# Altium schematic sheet MCU.SchDoc
size Letter; SheetNumber: 1; SheetTotal: 3
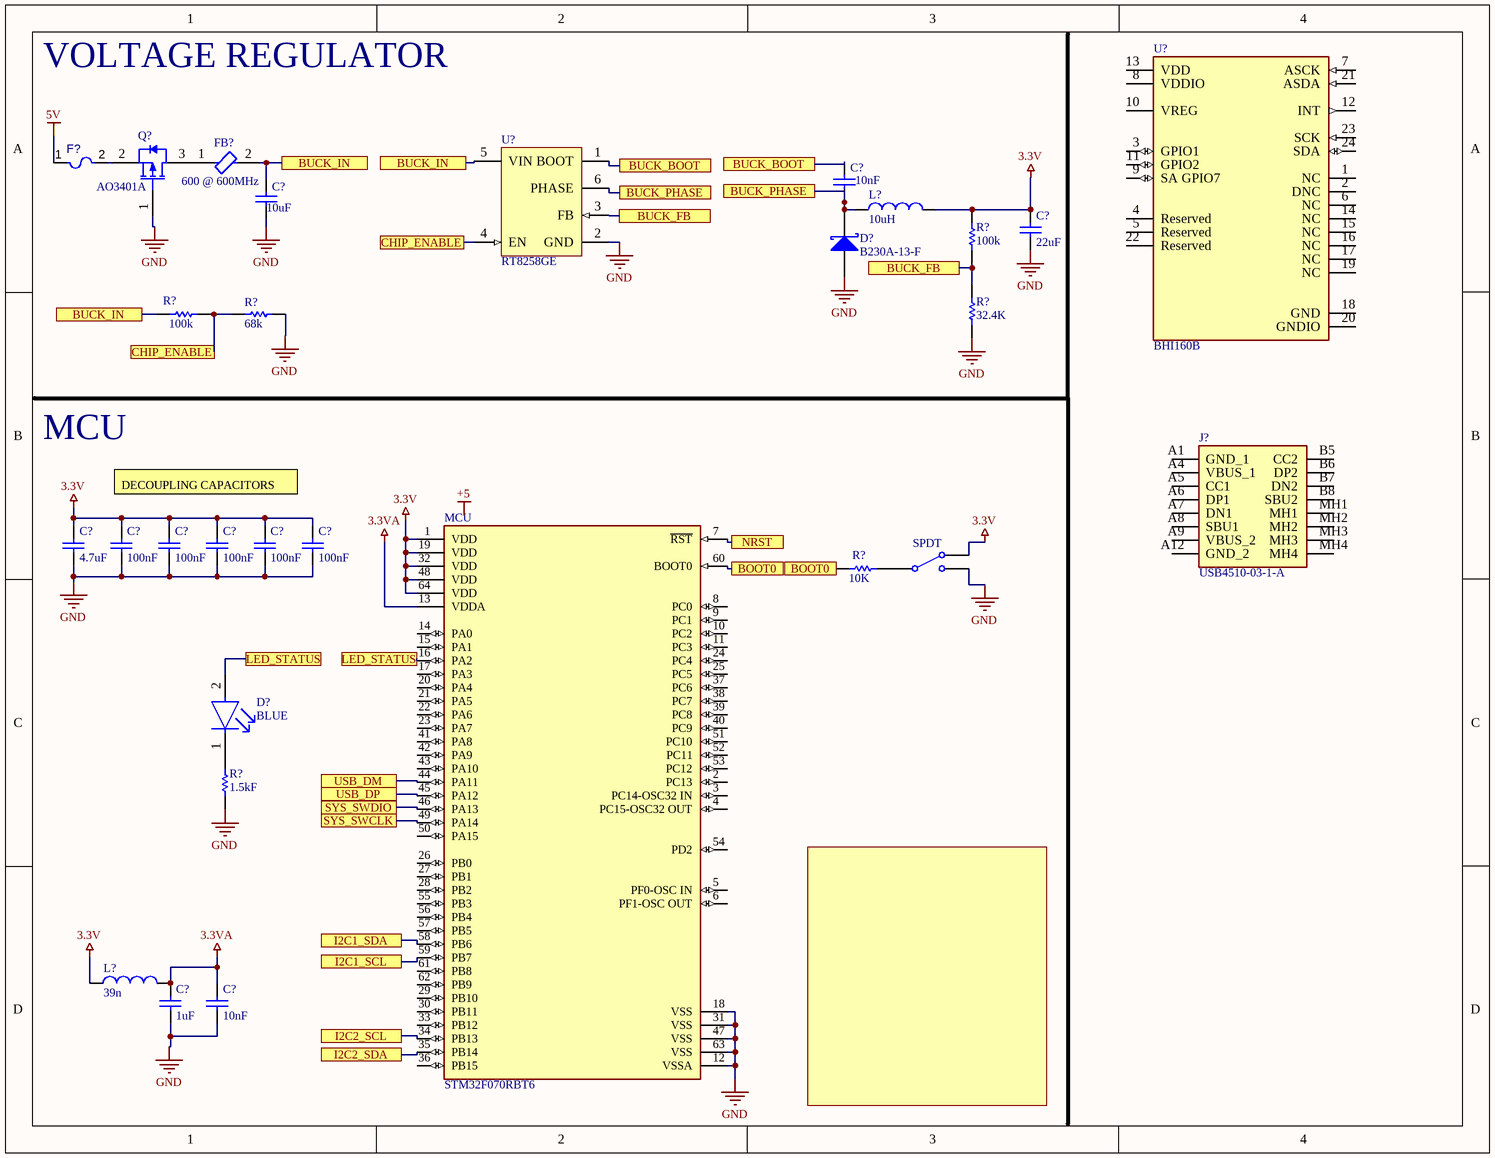
[diagram p0: MCU.SchDoc]

## Parts
(Parts that share a designator on the sheet are numbered #1, #2 ... from top to bottom, then left to right.)
C?#1  value 10nF  (hidden comment: Capacitor)
C?#2  value 10uF  (hidden comment: Capacitor)
C?#3  value 22uF  (hidden comment: Capacitor)
C?#4  value 4.7uF  (hidden comment: Capacitor)
C?#5  value 100nF  (hidden comment: Capacitor)
C?#6  value 100nF  (hidden comment: Capacitor)
C?#7  value 100nF  (hidden comment: Capacitor)
C?#8  value 100nF  (hidden comment: Capacitor)
C?#9  value 100nF  (hidden comment: Capacitor)
C?#10  value 1uF  (hidden comment: Capacitor)
C?#11  value 10nF  (hidden comment: Capacitor)
D?#1  B230A-13-F  [DIOD-SMA-2_V]
D?#2  BLUE  [FP-LTST-C191TBKT-MFG]
F?  (no value)  [LFUS-1812L050_V]
FB?  600 @ 600MHz  [FP-BLM15-0_05-IPC_B]
J?  USB4510-03-1-A  [USB4510031A]
L?#1  value 10uH  (hidden comment: Inductor)
L?#2  value 39n  (hidden comment: Inductor)
MCU  STM32F070RBT6  [FP-LQFP64-5W-MFG]
Q?  AO3401A  [AO-SOT-23-3L_V]
R?#1  value 100k  (hidden comment: Resistor)
R?#2  value 100k  (hidden comment: Resistor)
R?#3  value 68k  (hidden comment: Resistor)
R?#4  value 32.4K  (hidden comment: Resistor)
R?#5  value 10K  (hidden comment: Resistor)
R?#6  value 1.5kF  (hidden comment: Resistor)
SPDT  Single-Pole, Double-Throw Switch  (value not drawn)
U?#1  BHI160B  [FP-BHI160B-MFG]
U?#2  RT8258GE  [RCHT-SOT-23-6_L]

## Ports
BOOT0 (see MCU[2B]), BOOT0 (see MCU[3B]), BUCK_BOOT (see MCU[2A]), BUCK_FB (see MCU[2A]), BUCK_FB (see MCU[3A]), BUCK_IN (see MCU[1A], MCU[1B]), BUCK_IN (see MCU[1A], MCU[2A]), BUCK_IN (see MCU[1B], MCU[2A]), BUCK_PHASE (see MCU[2A]), CHIP_ENABLE (see MCU[1B]), CHIP_ENABLE (see MCU[2A]), I2C1_SCL, I2C1_SDA, I2C2_SCL, I2C2_SDA, LED_STATUS (see MCU[1C]), NRST, SYS_SWCLK, SYS_SWDIO, USB_DM, USB_DP

## Nets
3.3V: C?#3.2 C?#4.2 C?#5.2 C?#6.2 C?#7.2 C?#8.2 C?#9.2 L?#1.2 L?#2.1 MCU.1(VDD) MCU.19(VDD) MCU.32(VDD) MCU.48(VDD) MCU.64(VDD) R?#1.2 SPDT.3
3.3VA: C?#10.2 C?#11.2 L?#2.2 MCU.13(VDDA)
5V: F?.1
GND: C?#2.1 C?#3.1 C?#4.1 C?#5.1 C?#6.1 C?#7.1 C?#8.1 C?#9.1 C?#10.1 C?#11.1 D?#1.1(A) MCU.12(VSSA) MCU.18(VSS) MCU.31(VSS) MCU.47(VSS) MCU.63(VSS) Q?.1(GATE) R?#3.1 R?#4.1 R?#6.1 SPDT.2 U?#2.2(GND)
BOOT0: MCU.60(BOOT0) R?#5.1 ; port BOOT0
BUCK_BOOT: C?#1.2 U?#2.1(BOOT) ; port BUCK_BOOT
BUCK_FB: R?#1.1 R?#4.2 U?#2.3(FB) ; port BUCK_FB
BUCK_IN: C?#2.2 FB?.2 R?#2.2 U?#2.5(VIN) ; port BUCK_IN
BUCK_PHASE: C?#1.1 D?#1.2(K) L?#1.1 U?#2.6(PHASE) ; port BUCK_PHASE
CHIP_ENABLE: R?#2.1 R?#3.2 U?#2.4(EN) ; port CHIP_ENABLE
I2C1_SCL: MCU.59(PB7) ; port I2C1_SCL
I2C1_SDA: MCU.58(PB6) ; port I2C1_SDA
I2C2_SCL: MCU.34(PB13) ; port I2C2_SCL
I2C2_SDA: MCU.35(PB14) ; port I2C2_SDA
LED_STATUS: D?#2.2(A) MCU.16(PA2) ; port LED_STATUS
NRST: MCU.7(~{RST}) ; port NRST
SYS_SWCLK: MCU.49(PA14) ; port SYS_SWCLK
SYS_SWDIO: MCU.46(PA13) ; port SYS_SWDIO
USB_DM: MCU.44(PA11) ; port USB_DM
USB_DP: MCU.45(PA12) ; port USB_DP
NetD?#2_1: D?#2.1(C) R?#6.2
NetF?_2: F?.2 Q?.2(SOURCE)

Not connected (* = marked no-connect by the designer): FB? 1; J? A1(GND_1) A4(VBUS_1) A5(CC1) A6(DP1) A7(DN1) A8(SBU1) A9(VBUS_2) A12(GND_2) B5(CC2) B6(DP2) B7(DN2) B8(SBU2) MH1 MH2 MH3 MH4; MCU 2(PC13) 3(PC14-OSC32_IN) 4(PC15-OSC32_OUT) 5(PF0-OSC_IN) 6(PF1-OSC_OUT) 8(PC0) 9(PC1) 10(PC2) 11(PC3) 14(PA0) 15(PA1) 17(PA3) 20(PA4) 21(PA5) 22(PA6) 23(PA7) 24(PC4) 25(PC5) 26(PB0) 27(PB1) 28(PB2) 29(PB10) 30(PB11) 33(PB12) 36(PB15) 37(PC6) 38(PC7) 39(PC8) 40(PC9) 41(PA8) 42(PA9) 43(PA10) 50(PA15) 51(PC10) 52(PC11) 53(PC12) 54(PD2) 55(PB3) 56(PB4) 57(PB5) 61(PB8) 62(PB9); Q? 3(DRAIN); R?#5 2; SPDT 1; U?#1 1(NC) 2(DNC) 3(GPIO1) 4(Reserved) 5(Reserved) 6(NC) 7(ASCK) 8(VDDIO) 9(SA_GPIO7) 10(VREG) 11(GPIO2) 12(INT) 13(VDD) 14(NC) 15(NC) 16(NC) 17(NC) 18(GND) 19(NC) 20(GNDIO) 21(ASDA) 22(Reserved) 23(SCK) 24(SDA)

## Notes on the sheet
- VOLTAGE REGULATOR
- MCU
- (near C?#5) DECOUPLING CAPACITORS
- Labels drawn without touching a wire or pin: +5
- Title:
- Drawn By:
- Page Contents:
- Checked By:
- Size:
- Date:
- File:
- License:
- Email:
- A4
- Number:
- Time:
- Revision:
- Sheet
- Website:
- of

## Library data of the parts
C?#1-C?#11 = Capacitor: SimulationGenericComponent: True
D?#1 = CMP-0905-00001-1: 2 A Surface Mount Schottky Barrier Rectifier, 30 V, -65 to 150 degC, 2-Pin SMA, RoHS, Tape and Reel; Manufacturer: Diodes Inc; VRRM: 30 V; IO: 2 A Max.; CT: 200 pF; IFSM: 50 A; VF: 0.5 V; IF: 2 A; ComponentLink1Description: Manufacturer URL; PackageDescription: 2-Pin SMA, Body 4.3 x 2.605 mm, Height 2.3 mm; Mounting Technology: Surface Mount; ComponentLink1URL: http://diodes.com/; VR: 30 V; PackageReference: SMA-2; RoHS: TRUE; ComponentLink2URL: http://diodes.com/datasheets/ds13004.pdf; Packing: Tape and Reel; DatasheetVersion: Rev. 21 - 2; ComponentLink2Description: Datasheet; Temperature Range: -65 to 150 degC; PartNumber: B230A-13-F
D?#2 = CMP-22017-000008-1: LTST-C191TBKT; Lens Color: Colorless; Dominant Wavelength: 475nm; Forward Current: 20mA; Wavelength: 468nm; Viewing Angle: 130°; Lens Transparency: Clear; Power Dissipation: 76mW; Luminous Intensity: 180mcd; Reverse Voltage: 5V; Number of Elements: 1; Lens Style: Diffused; Forward Voltage: 3.8V; Max Power Dissipation: 75mW; Case Code (Metric): 1608; Packaging: Tape and Reel; Case/Package: 0603; Depth: 1.6mm; Mount: Surface Mount; Lead Free: Lead Free; Min Operating Temperature: -20°C; Illumination Color: Blue; Height: 0.55mm; Test Current: 20mA; Case Code (Imperial): 0603; Max Operating Temperature: 80°C; Number of Pins: 2; Length: 0.8mm; Radiation Hardening: No; Package Quantity: 1; Number of LEDs: 1; Width: 0.8mm; Color: Blue
F? = CMP-005-00004-3: Manufacturer: Littelfuse; Nominal Supply Voltage: 15V; Resistance: 1Ohm; Current Rating: 100A; Min Operating Temperature: -40°C; Package Description: 2-Pin Surface Mount Device, Body 4.55 x 3.24 mm; Package Quantity: 1; RoHS Compliant: True; Datasheet Version: Feb-16; Datasheet URL: http://www.littelfuse.com/~/media/electronics/datasheets/resettable_ptcs/littelfuse_ptc_1812l_datasheet.pdf.pdf; Case/Package: 1812; Packaging: TapeandReel; Voltage Rating: 15V; Max Operating Temperature: 85°C; Package Reference: 1812; Mounting Technology: SM
FB? = CMP-0686-00181-5: DC Current: 200mA; Number of Circuits: 1; Shielding: Unshielded; Tolerance: 25%; Material: Ferrite; Max Current Rating: 300mA; Impedance: 1kR; Test Frequency: 100MHz; DC Resistance (DCR): 650mR; DC Resistance-Max: 1R; Packaging: Tape and Reel; Case Code (Imperial): 0402; Military Standard: Not; Min Operating Temperature: -55°C; Width: 0.5mm; Number of Lines: 1; Depth: 0.55mm; Package Quantity: 1; Case/Package: 0402; Series: BLM15AG_SN; Case Code (Metric): 1005; Max Operating Temperature: 125°C; Lead Free: Lead Free; RoHS Compliant: Yes; Radiation Hardening: No; Number of Pins: 2; Core Material: Ferrite; Current Rating: 300mA; Frequency: 100MHz; Max DC Current: 200mA; REACH SVHC: No SVHC; Length: 1mm; Termination: SMD/SMT; Height: 0.5mm
J? = CMP-003-000000-1: Connector; Manufacturer_Name: GCT (GLOBAL CONNECTOR TECHNOLOGY); Source: SamacSys.SchLib; Mouser Price/Stock: https://www.mouser.co.uk/ProductDetail/GCT/USB4510-03-1-A?qs=7D1LtPJG0i3iod3O3OZ7LA%3D%3D; Height: 3.36mm; Mouser Part Number: 640-USB4510031A; Design Item ID: USB4510-03-1-A; Manufacturer_Part_Number: USB4510-03-1-A; Datasheet Link: https://gct.co/files/drawings/usb4510.pdf
L?#1 L?#2 = Inductor: SimulationGenericComponent: True
MCU = CMP-12105-000120-1: IC MCU 32BIT 128KB FLASH 64LQFP; RAM Size: 16KB; Number of I/Os: 51; Min Supply Voltage: 2.4V; Core Architecture: ARM; Max Frequency: 48MHz; Data Bus Width: 32b; Peripherals: POR; Interface: I2C; Max Power Dissipation: 455mW; Number of Timers/Counters: 8; Max Supply Voltage: 3.6V; Oscillator Type: Internal; Watchdog Timer: Yes; Max Operating Temperature: 85°C; Mount: Surface Mount; Frequency: 48MHz; Memory Size: 128KB; Packaging: Tray; Number of Pins: 64; Case/Package: LQFP; Memory Type: FLASH; Number of Programmable I/O: 51; REACH SVHC: No SVHC; Lead Free: Lead Free; Min Operating Temperature: -40°C
Q? = CMP-2000-05778-1: P-Channel MOSFET, 30 V, 4 A, -55 to 150 degC, 3-Pin SOT-23-3L, RoHS, Tape and Reel; Manufacturer: Alpha and Omega; Output Power (Max): NotRequiredW; Power Dissipation: 1.4W; Rad Hardened: No; Drain Efficiency: NotRequired%; Drain-Source On-Volt: 30V; Noise Figure: NotRequireddB; Frequency (Max): NotRequiredMHz; Number of  Elements: 1; Gate-Source Voltage (Max): ?12V; Drain Current (Max): 4A; Channel Mode: Enhancement; Drain-Source On-Res: 0.044ohm; Type: PowerMOSFET; Polarity: P; Package URL: http://www.aosmd.com/res/packaging_information/SOT-23-3L.pdf; Datasheet URL: http://www.aosmd.com/res/data_sheets/AO3401A.pdf; Package Type: SOT-23; Package Description: 3-Pin Small Outline Transistor, Body 2.95 x 1.6 mm, Pitch 0.95 mm; Mounting: SurfaceMount; Manufacturer URL: http://www.aosmd.com/; Continuous Drain Current: 4A; Package Reference: SOT-23-3L; Mounting Technology: SurfaceMount; Operating Temperature Classification: Military; Power Gain: NotRequireddB; Datasheet Version: Rev. 3, 03/2011; Operating Temp Range: -55Cto150C; Pin Count: 3
R?#1-R?#6 = Resistor: TC1: 0; SimulationGenericComponent: True; TC2: 0
SPDT = SPDT SW: nodeUP_closed: 1; Rclosed: 1m; Ropen: 1Meg; SimulationGenericComponent: True
U?#1 = CMP-191067-000004-1: IMU ACCEL/GYRO 3-AXIS I2C 24LGA; Manufacturer: Bosch Sensortec; Accel Resolution: 16bits; Operating Supply Current: 300-800uA; Sensor Type: Temperature,Accelerometer,Gyroscope; Accel Range: 2/4/8/16g; Gyro Sensitivity: 16.4/32.8/65.6/131.2/262.4LSB/°/s; Min Supply Voltage: 1.6V; Gyro Range: 125/250/500/1000/2000°/s; Accel Sensitivity: 2048/4096/8192/16384LSB/g; Max Supply Voltage: 3.6V; Sensor Output: I2C; Lead Free: Yes; Temperature: -40°C to +85°C; Height: 1mm; Ambient Temperature Range High: +85°C; Manufacturer Part Number: BHI160B; Temperature Range Low: -40°C; Category: IC; Octopart: https://octopart.com/bhi160b-bosch+sensortec-108216126; ComponentLink2URL: https://ae-bst.resource.bosch.com/media/_tech/media/datasheets/BST-BHI160B-DS000.pdf; RoHS: TRUE; Ambient Temperature Range Low: -40°C; Digikey Description: IMU ACCEL/GYRO 3-AXIS I2C 24LGA; Device Class L1: Sensors; Temperature Range High: +85°C; ComponentLink2Description: Datasheet; Package: 0; Device Class L2: Motion Sensors; Device Class L3: Inertial Measurement Units (IMUs); Automotive: No; Resolution: 16bits
U?#2 = CMP-0917-00001-1: 1.2 A, 24 V, 700 kHz Step-Down Converter, -40 to 85 degC, 6-Pin SOT-23, RoHS; Manufacturer: Richtek Technology; Output Current: 1.2 A; Wide Operating Input Voltage Range: 4.5 to 24 V; Switch on Resistance: 0.3 Ohm; Fixed Switching Frequency: 700 kHz; Adjustable Output Voltage Range: 0.8 to 15 V; PackageReference: SOT-23-6; PartNumber: RT8258GE; PackageDescription: 6-Pin Small Outline Transistor, Body 2.8955 x 1.6 mm, Pitch 0.9395 mm; ComponentLink2URL: http://www.richtek.com/download_ds.jsp?s=420; ComponentLink1URL: http://www.richtek.com/; Mounting Technology: Surface Mount; RoHS: TRUE; ComponentLink1Description: Manufacturer URL; DatasheetVersion: Dec-11; Temperature Range: -40 to 85 degC; ComponentLink2Description: Datasheet